# Altium schematic sheet MB1829_TOP.SchDoc: MB1829 TOP
size A4; Date: Not used; ApprovedBy: Not used; CheckedBy: Not used; Author: Not used; CompanyName: STMicroelectronics; DrawnBy: Not used; Engineer: Not used; Organization: Not used; Address1: Not used; Address2: Not used; Address3: Not used; Address4: Not used; DocumentNumber: Not used; Revision: Not used; SheetNumber: 2; SheetTotal: 16; CurrentTime: Not used; CurrentDate: Not used; Time: Not used; DocumentFullPathAndName: Not used; DocumentName: Not used; ModifiedDate: Not used; ImagePath: Not used; ProjectName: Not used; Application_BuildNumber: Not used
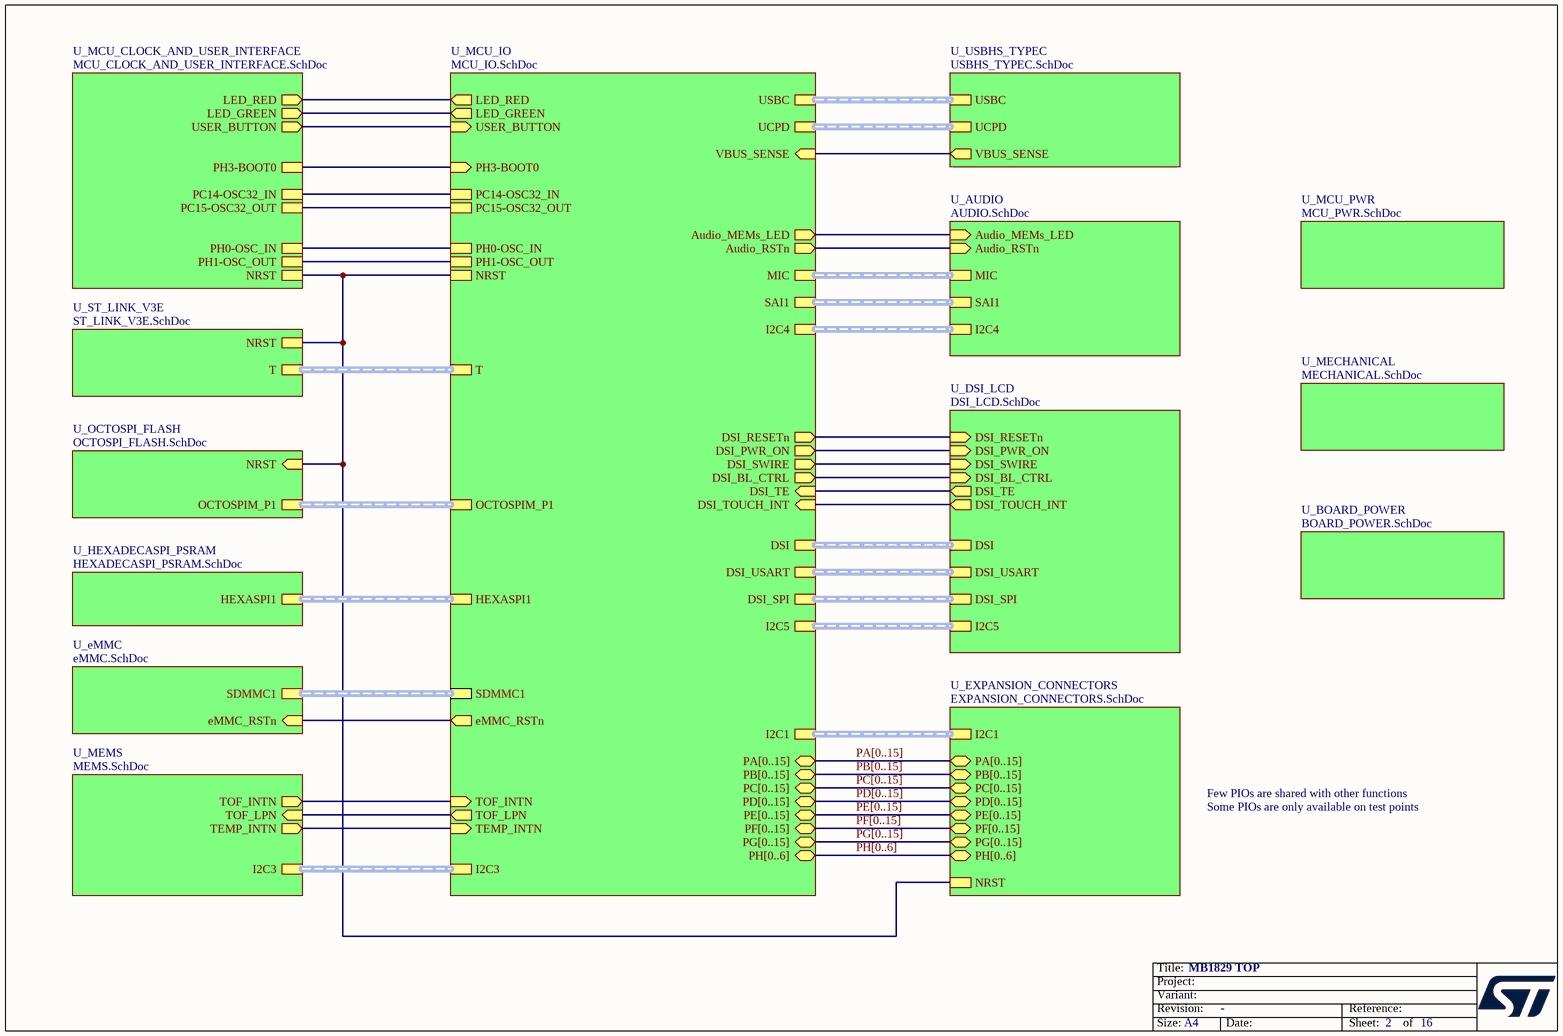
[diagram p0: MB1829_TOP.SchDoc]

## Sub-sheets
U_AUDIO = AUDIO.SchDoc: MIC (harness MIC), I2C4 (harness I2C4), SAI1 (harness SAI), Audio_RSTn (in), Audio_MEMs_LED (in)
U_BOARD_POWER = BOARD_POWER.SchDoc: no entries
U_DSI_LCD = DSI_LCD.SchDoc: DSI_RESETn (in), DSI_PWR_ON (in), DSI_SWIRE (in), DSI_BL_CTRL (in), DSI_TE (out), DSI_TOUCH_INT (out), DSI (harness DSI_LANES), I2C5 (harness I2C5), DSI_USART (harness DSI_USART), DSI_SPI (harness DSI_SPI)
U_eMMC = eMMC.SchDoc: eMMC_RSTn (in), SDMMC1 (harness eMMC)
U_EXPANSION_CONNECTORS = EXPANSION_CONNECTORS.SchDoc: NRST, I2C1 (harness I2C1), PC[0..15] (bidir), PA[0..15] (bidir), PB[0..15] (bidir), PD[0..15] (bidir), PE[0..15] (bidir), PH[0..6] (bidir), PF[0..15] (bidir), PG[0..15] (bidir)
U_HEXADECASPI_PSRAM = HEXADECASPI_PSRAM.SchDoc: HEXASPI1 (harness HEXASPI1)
U_MCU_CLOCK_AND_USER_INTERFACE = MCU_CLOCK_AND_USER_INTERFACE.SchDoc: NRST, PH3-BOOT0, PC14-OSC32_IN, PC15-OSC32_OUT, LED_RED (out), LED_GREEN (out), PH0-OSC_IN, PH1-OSC_OUT, USER_BUTTON (out)
U_MCU_IO = MCU_IO.SchDoc: PH3-BOOT0 (in), NRST, PH0-OSC_IN, PH1-OSC_OUT, PC14-OSC32_IN, PC15-OSC32_OUT, LED_RED (out), LED_GREEN (out), OCTOSPIM_P1 (harness OCTOSPI1), USBC (harness USBC), MIC (harness MIC), T (harness T), HEXASPI1 (harness HEXASPI1), SDMMC1 (harness eMMC), eMMC_RSTn (out), I2C4 (harness I2C4), SAI1 (harness SAI), USER_BUTTON (in), Audio_RSTn (out), I2C5 (harness I2C5), DSI_RESETn (out), DSI_PWR_ON (out), DSI_SWIRE (out), DSI_BL_CTRL (out), DSI_TE (in), DSI_TOUCH_INT (in), DSI_SPI (harness DSI_SPI), DSI_USART (harness DSI_USART), DSI (harness DSI_LANES), UCPD (harness UCPD_CTRL), VBUS_SENSE (in), PA[0..15] (bidir), PC[0..15] (bidir), PB[0..15] (bidir), PD[0..15] (bidir), PE[0..15] (bidir), PH[0..6] (bidir), PF[0..15] (bidir), PG[0..15] (bidir), I2C1 (harness I2C1), I2C3 (harness I2C3), TOF_INTN (in), TEMP_INTN (in), TOF_LPN (out), Audio_MEMs_LED (out)
U_MCU_PWR = MCU_PWR.SchDoc: no entries
U_MECHANICAL = MECHANICAL.SchDoc: no entries
U_MEMS = MEMS.SchDoc: I2C3 (harness I2C3), TOF_INTN (out), TOF_LPN (in), TEMP_INTN (out)
U_OCTOSPI_FLASH = OCTOSPI_FLASH.SchDoc: NRST (in), OCTOSPIM_P1 (harness OCTOSPI1)
U_ST_LINK_V3E = ST_LINK_V3E.SchDoc: NRST, T (harness T)
U_USBHS_TYPEC = USBHS_TYPEC.SchDoc: USBC (harness USBC), UCPD (harness UCPD_CTRL), VBUS_SENSE (out)

## Nets
(unnamed): sheet U_EXPANSION_CONNECTORS/NRST, sheet U_MCU_CLOCK_AND_USER_INTERFACE/NRST, sheet U_MCU_IO/NRST, sheet U_OCTOSPI_FLASH/NRST, sheet U_ST_LINK_V3E/NRST
(unnamed): sheet U_AUDIO/Audio_RSTn, sheet U_MCU_IO/Audio_RSTn
(unnamed): sheet U_AUDIO/Audio_MEMs_LED, sheet U_MCU_IO/Audio_MEMs_LED
(unnamed): sheet U_MCU_CLOCK_AND_USER_INTERFACE/PH3-BOOT0, sheet U_MCU_IO/PH3-BOOT0
(unnamed): sheet U_MCU_CLOCK_AND_USER_INTERFACE/PC14-OSC32_IN, sheet U_MCU_IO/PC14-OSC32_IN
(unnamed): sheet U_MCU_CLOCK_AND_USER_INTERFACE/PC15-OSC32_OUT, sheet U_MCU_IO/PC15-OSC32_OUT
(unnamed): sheet U_MCU_CLOCK_AND_USER_INTERFACE/LED_RED, sheet U_MCU_IO/LED_RED
(unnamed): sheet U_MCU_CLOCK_AND_USER_INTERFACE/LED_GREEN, sheet U_MCU_IO/LED_GREEN
(unnamed): sheet U_MCU_CLOCK_AND_USER_INTERFACE/PH0-OSC_IN, sheet U_MCU_IO/PH0-OSC_IN
(unnamed): sheet U_MCU_CLOCK_AND_USER_INTERFACE/PH1-OSC_OUT, sheet U_MCU_IO/PH1-OSC_OUT
(unnamed): sheet U_MCU_CLOCK_AND_USER_INTERFACE/USER_BUTTON, sheet U_MCU_IO/USER_BUTTON
(unnamed): sheet U_MCU_IO/eMMC_RSTn, sheet U_eMMC/eMMC_RSTn
(unnamed): sheet U_MCU_IO/DSI_RESETn, sheet U_DSI_LCD/DSI_RESETn
(unnamed): sheet U_MCU_IO/DSI_PWR_ON, sheet U_DSI_LCD/DSI_PWR_ON
(unnamed): sheet U_MCU_IO/DSI_SWIRE, sheet U_DSI_LCD/DSI_SWIRE
(unnamed): sheet U_MCU_IO/DSI_BL_CTRL, sheet U_DSI_LCD/DSI_BL_CTRL
(unnamed): sheet U_MCU_IO/DSI_TE, sheet U_DSI_LCD/DSI_TE
(unnamed): sheet U_MCU_IO/DSI_TOUCH_INT, sheet U_DSI_LCD/DSI_TOUCH_INT
(unnamed): sheet U_MCU_IO/VBUS_SENSE, sheet U_USBHS_TYPEC/VBUS_SENSE
(unnamed): sheet U_MCU_IO/TOF_INTN, sheet U_MEMS/TOF_INTN
(unnamed): sheet U_MCU_IO/TEMP_INTN, sheet U_MEMS/TEMP_INTN
(unnamed): sheet U_MCU_IO/TOF_LPN, sheet U_MEMS/TOF_LPN

## Buses and harness runs
bus PA[0..15] = sheet U_EXPANSION_CONNECTORS/PA[0..15] = sheet U_MCU_IO/PA[0..15]
bus PB[0..15] = sheet U_EXPANSION_CONNECTORS/PB[0..15] = sheet U_MCU_IO/PB[0..15]
bus PC[0..15] = sheet U_EXPANSION_CONNECTORS/PC[0..15] = sheet U_MCU_IO/PC[0..15]
bus PD[0..15] = sheet U_EXPANSION_CONNECTORS/PD[0..15] = sheet U_MCU_IO/PD[0..15]
bus PE[0..15] = sheet U_EXPANSION_CONNECTORS/PE[0..15] = sheet U_MCU_IO/PE[0..15]
bus PF[0..15] = sheet U_EXPANSION_CONNECTORS/PF[0..15] = sheet U_MCU_IO/PF[0..15]
bus PG[0..15] = sheet U_EXPANSION_CONNECTORS/PG[0..15] = sheet U_MCU_IO/PG[0..15]
bus PH[0..6] = sheet U_EXPANSION_CONNECTORS/PH[0..6] = sheet U_MCU_IO/PH[0..6]
harness sheet U_AUDIO/I2C4 = sheet U_MCU_IO/I2C4
harness sheet U_AUDIO/MIC = sheet U_MCU_IO/MIC
harness sheet U_AUDIO/SAI1 = sheet U_MCU_IO/SAI1
harness sheet U_DSI_LCD/DSI = sheet U_MCU_IO/DSI
harness sheet U_DSI_LCD/DSI_SPI = sheet U_MCU_IO/DSI_SPI
harness sheet U_DSI_LCD/DSI_USART = sheet U_MCU_IO/DSI_USART
harness sheet U_DSI_LCD/I2C5 = sheet U_MCU_IO/I2C5
harness sheet U_eMMC/SDMMC1 = sheet U_MCU_IO/SDMMC1
harness sheet U_EXPANSION_CONNECTORS/I2C1 = sheet U_MCU_IO/I2C1
harness sheet U_HEXADECASPI_PSRAM/HEXASPI1 = sheet U_MCU_IO/HEXASPI1
harness sheet U_MCU_IO/I2C3 = sheet U_MEMS/I2C3
harness sheet U_MCU_IO/OCTOSPIM_P1 = sheet U_OCTOSPI_FLASH/OCTOSPIM_P1
harness sheet U_MCU_IO/T = sheet U_ST_LINK_V3E/T
harness sheet U_MCU_IO/UCPD = sheet U_USBHS_TYPEC/UCPD
harness sheet U_MCU_IO/USBC = sheet U_USBHS_TYPEC/USBC

## Notes on the sheet
- Few PIOs are shared with other functions
- Some PIOs are only available on test points
- Title:
- Project:
- Size:
- Revision:
- Variant:
- A4
- -
- Date:
- Reference:
- Sheet:
- of